# Altium schematic sheet OK1050-C_1.2_Camera.SchDoc
size A3; Revision: 1.2; SheetNumber: 1; SheetTotal: 7
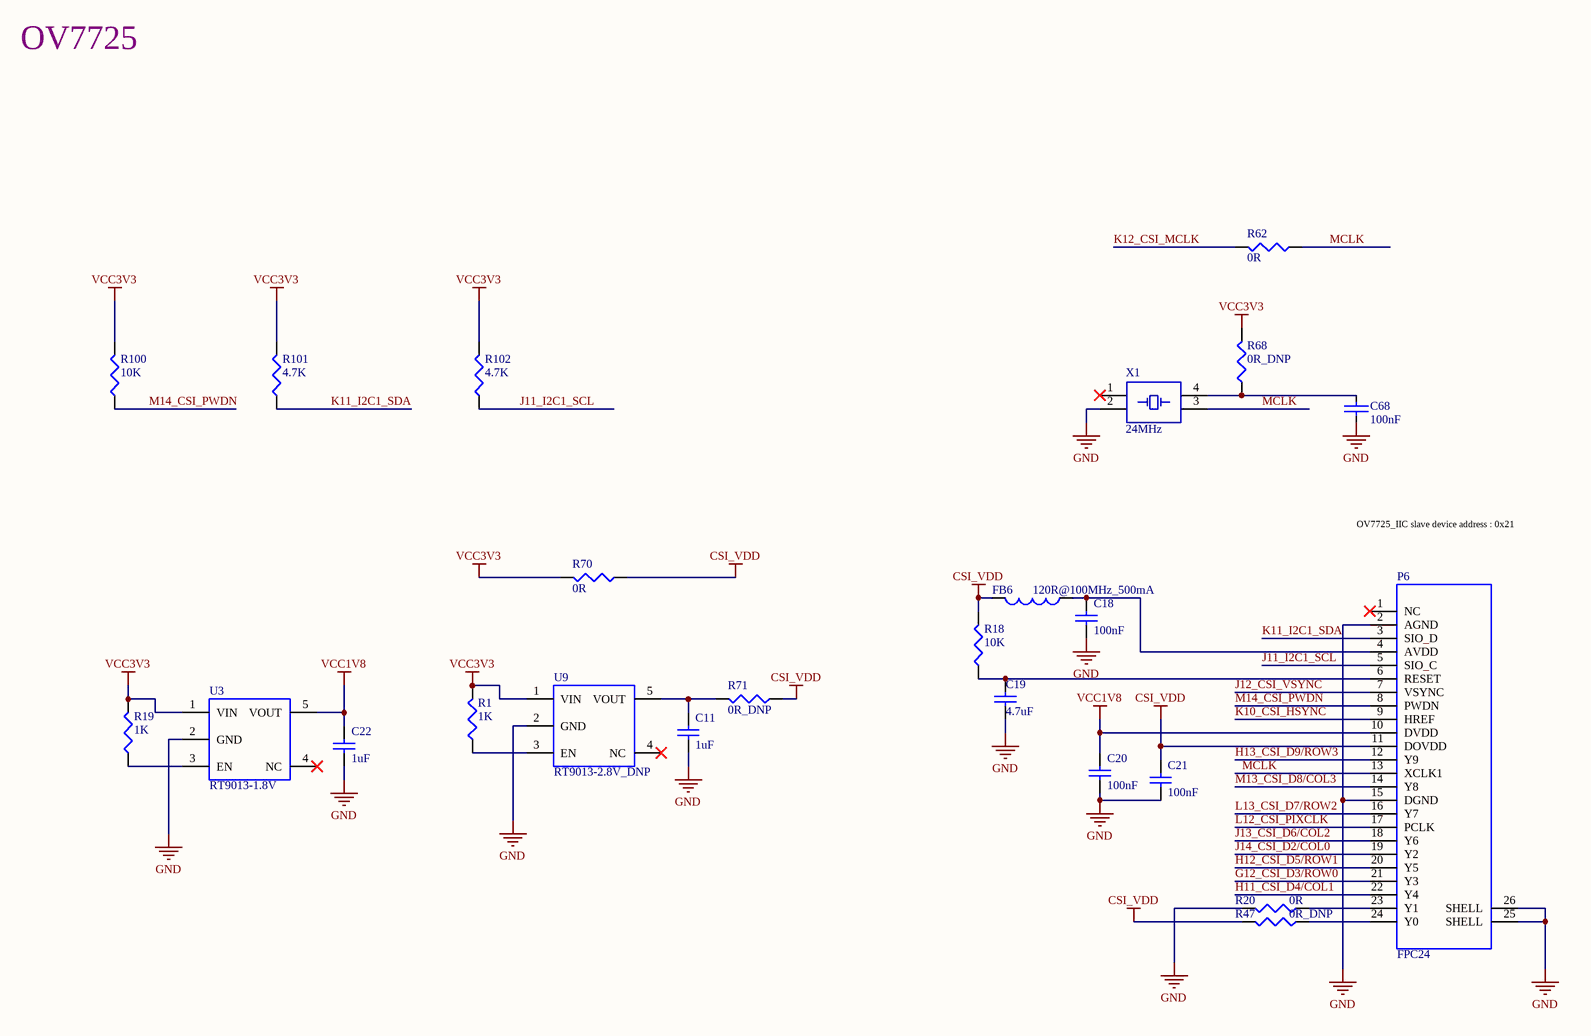
[diagram p0: OK1050-C_1.2_Camera.SchDoc]

## Parts
C11  1uF  [0603C+]
C18  100nF  [0603C+]
C19  value 4.7uF  [0603C+]  (hidden comment: 0.1uF)
C20  value 100nF  [0603C+]  (hidden comment: 0.1uF)
C21  100nF  [0603C+]
C22  1uF  [0603C+]
C68  100nF  [0603C+]
FB6  120R@100MHz_500mA  [0603R+]
P6  FPC24  [FPC24]
R1  1K  [0603R+]
R18  10K  [0603R+]
R19  1K  [0603R+]
R20  0R  [0603R+]
R47  0R_DNP  [0603R+]
R62  0R  [0603R+]
R68  0R_DNP  [0603R+]
R70  0R  [0603R+]
R71  0R_DNP  [0603R+]
R100  10K  [0603R+]
R101  4.7K  [0603R+]
R102  4.7K  [0603R+]
U3  RT9013-1.8V  [SOT95P280X129-5N]
U9  RT9013-2.8V_DNP  [SOT95P280X129-5N]
X1  24MHz  [CRYSTALS_3225SP]

## Nets
CSI_VDD: C21.1 FB6.2 P6.11(DOVDD) R18.2 R47.2 R70.1 R71.1
GND: C11.1 C18.2 C19.2 C20.2 C21.2 C22.1 C68.1 P6.2(AGND) P6.15(DGND) P6.25(SHELL) P6.26(SHELL) R20.2 U3.2(GND) U9.2(GND) X1.2
VCC1V8: C20.1 C22.2 P6.10(DVDD) U3.5(VOUT)
VCC3V3: R1.2 R19.2 R68.2 R70.2 R100.2 R101.2 R102.2 U3.1(VIN) U9.1(VIN)
G12_CSI_D3/ROW0: P6.21(Y3)
H11_CSI_D4/COL1: P6.22(Y4)
H12_CSI_D5/ROW1: P6.20(Y5)
H13_CSI_D9/ROW3: P6.12(Y9)
J11_I2C1_SCL: P6.5(SIO_C) R102.1
J12_CSI_VSYNC: P6.7(VSYNC)
J13_CSI_D6/COL2: P6.18(Y6)
J14_CSI_D2/COL0: P6.19(Y2)
K10_CSI_HSYNC: P6.9(HREF)
K11_I2C1_SDA: P6.3(SIO_D) R101.1
K12_CSI_MCLK: R62.2
L12_CSI_PIXCLK: P6.17(PCLK)
L13_CSI_D7/ROW2: P6.16(Y7)
M13_CSI_D8/COL3: P6.14(Y8)
M14_CSI_PWDN: P6.8(PWDN) R100.1
MCLK: P6.13(XCLK1) R62.1 X1.3
NetC11_2: C11.2 R71.2 U9.5(VOUT)
NetC18_1: C18.1 FB6.1 P6.4(AVDD)
NetC19_1: C19.1 P6.6(RESET) R18.1
NetC68_2: C68.2 R68.1 X1.4
NetP6_23: P6.23(Y1) R20.1
NetP6_24: P6.24(Y0) R47.1
NetR1_1: R1.1 U9.3(EN)
NetR19_1: R19.1 U3.3(EN)

Not connected (* = marked no-connect by the designer): P6 1(NC)*; U3 4(NC)*; U9 4(NC)*; X1 1*

## Notes on the sheet
- OV7725
- OV7725_IIC slave device address : 0x21
- 设计
- 审核
- 工艺
- 图纸名称
- 孙木
- 批准
- 标准化
- 日期
- 版本
- 页码
- 第
- 页
- 共

## Library data of the parts
C11 C18-C22 = Cap: Capacitor; Published: 8-Jun-2000; LatestRevisionDate: 17-Jul-2002; LatestRevisionNote: Re-released for DXP Platform.; PackageReference: RAD-0.3; Publisher: Altium Limited; PackageDescription: Radial Cap, Thru-Hole; 2 Leads; 0.3 in Pin Spacing
  C11 C22: Value: 1uF
  C18 C21: Value: 100nF
C68 = CAP_1
FB6 = Inductor: Code_IEC: 1005; Published: 8-Jun-2000; LatestRevisionDate: 29-May-2009; LatestRevisionNote: IPC-7351 Footprint Added.; PackageReference: 0402-A; Publisher: Altium Limited; PackageDescription: Chip Inductor; Code_JEITA: 0402; Value: 120R@100MHz_500mA
P6 = CON24
R1 R18-R20 R47 R62 R68 R70 R71 R100-R102 = Res3: Resistor; Published: 8-Jun-2000; LatestRevisionDate: 29-May-2009; LatestRevisionNote: IPC-7351 Footprint Added.; PackageReference: J1-0603; Publisher: Altium Limited; PackageDescription: Chip Resistor
  R1 R19: Value: 1K
  R18 R100: Value: 10K
  R20 R62 R70: Value: 0R
  R47 R68 R71: Value: 0R_DNP
  R101 R102: Value: 4.7K
U3 U9 = RT9013
X1 = oscillator_4PINsp: Value: 24MHz